# EAGLE design shield (EAGLE 6.4)
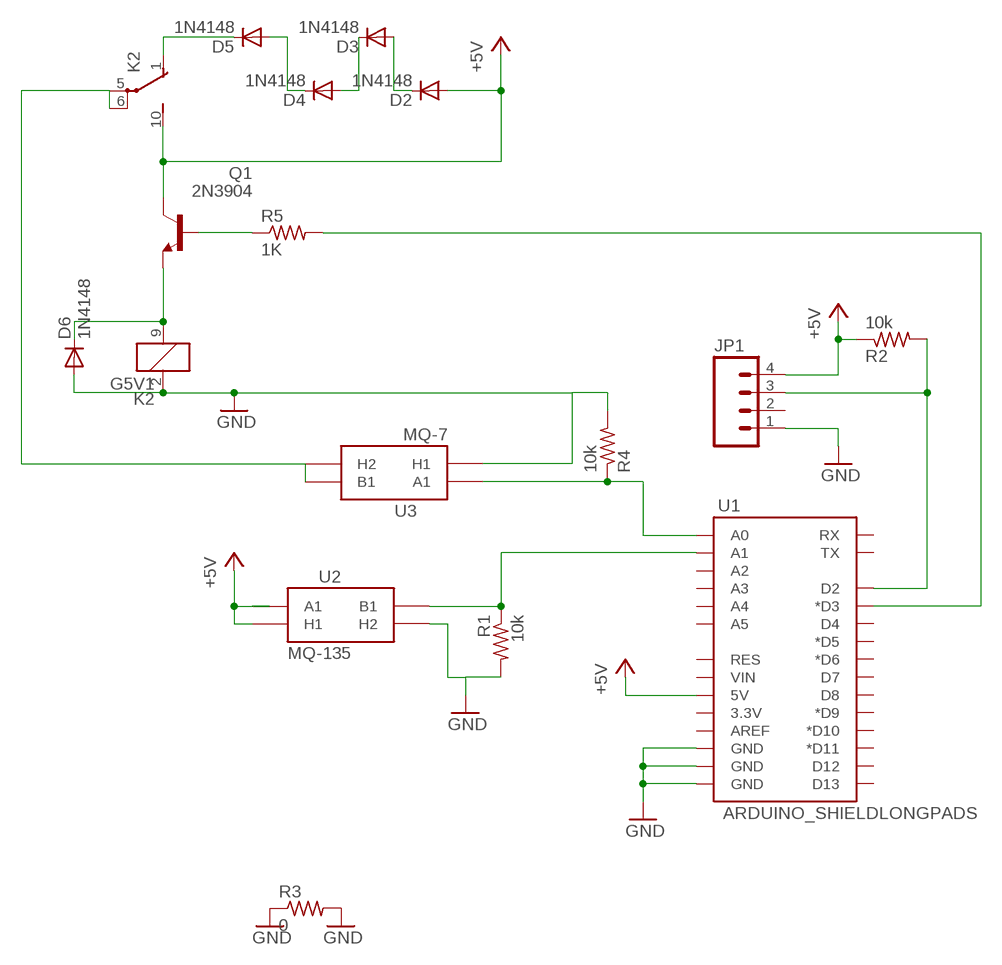
[diagram p0: schematic, sheet 1]

## Parts
D2  1N4148  1N4148DO35-7  [DO35-7]
D3  1N4148  1N4148DO35-7  [DO35-7]
D4  1N4148  1N4148DO35-7  [DO35-7]
D5  1N4148  1N4148DO35-7  [DO35-7]
D6  1N4148  1N4148DO35-7  [DO35-7]
JP1  M04LONGPADS  [1X04_LONGPADS]
K2  G5V1  [G5V1]
Q1  2N3904  [TO92]
R1  10k  R-US_0204/7  [0204/7]
R2  10k  R-US_0204/7  [0204/7]
R3  0  R-US_0204/7  [0204/7]
R4  10k  R-US_0204/7  [0204/7]
R5  1K  R-US_0204/7  [0204/7]
U1  ARDUINO_SHIELDLONGPADS  [DUEMILANOVE_SHIELD_LONGPADS]
U2  MQ-135  GAS_SENSOR  [MQ-3]
U3  MQ-7  GAS_SENSOR  [MQ-3]

## Nets
+5V: D2.A JP1.4 K2.10(2:S) Q1.1(C) R2.1 U1.5V U2.A1 U2.HA(H1)
GND: D6.A JP1.1 K2.2 R1.2 R3.1 R3.2 R4.2 U1.GND@0(GND) U1.GND@1(GND) U1.GND@2(GND) U2.HB(H2) U3.HA(H1)
N$1: R5.2 U1.D3(*D3)
N$2: R1.1 U1.A1 U2.B1
N$3: JP1.3 R2.2 U1.D2
N$7: D2.C D3.A
N$8: K2.5(2:P) K2.6(2:P) U3.B1 U3.HB(H2)
N$9: D3.C D4.A
N$10: D4.C D5.A
N$11: D5.C K2.1(2:O)
N$16: D6.C K2.9 Q1.3(E)
N$18: Q1.2(B) R5.1
SENSOROUT: R4.1 U1.A0 U3.A1
Unconnected: JP1.2 U1.3.3V U1.A2 U1.A3 U1.A4 U1.A5 U1.AREF U1.D4 U1.D5(*D5) U1.D6(*D6) U1.D7 U1.D8 U1.D9(*D9) U1.D10(*D10) U1.D11(*D11) U1.D12 U1.D13 U1.RES U1.RX U1.TX U1.VIN

## Library data of the parts
D2-D6 = diode:1N4148: DIODE high speed (Philips)
JP1 = SparkFun-Connectors:M04: Header 4 Standard 4-pin 0.1" header. Use with straight break away headers (SKU : PRT-00116), right angle break away headers (PRT-00553), swiss pins (PRT-00743), machine pins (PRT-00117), and female headers (PRT-00115). Molex polarized connector foot print use with SKU : PRT-08231 with associated crimp pins and housings. 1MM SMD Version SKU: PRT-10208
K2 = relay:G5V1: RELAY 1 x switch, 0.5 A/125 V AC, 1 A/24 V DC , Omron
Q1 = transistor-npn:2N3904: NPN Transistor
R1 R2 R4 = rcl:R-US_: RESISTOR, American symbol
R3 R5 = resistor:R-US_: RESISTOR, American symbol
U1 = SparkFun-Boards:ARDUINO_SHIELD: Arduino shield footprint
U2 = SparkFun-Sensors:GAS_SENSOR: MQ-3 alcohol gas sensor . FP not tested. SEN-08880.
U3 = SparkFun 2:GAS_SENSOR: MQ-3 Gas Sensor. FP not tested. Part#

## Net classes
0 default: clearance 0.355 mm

## Board
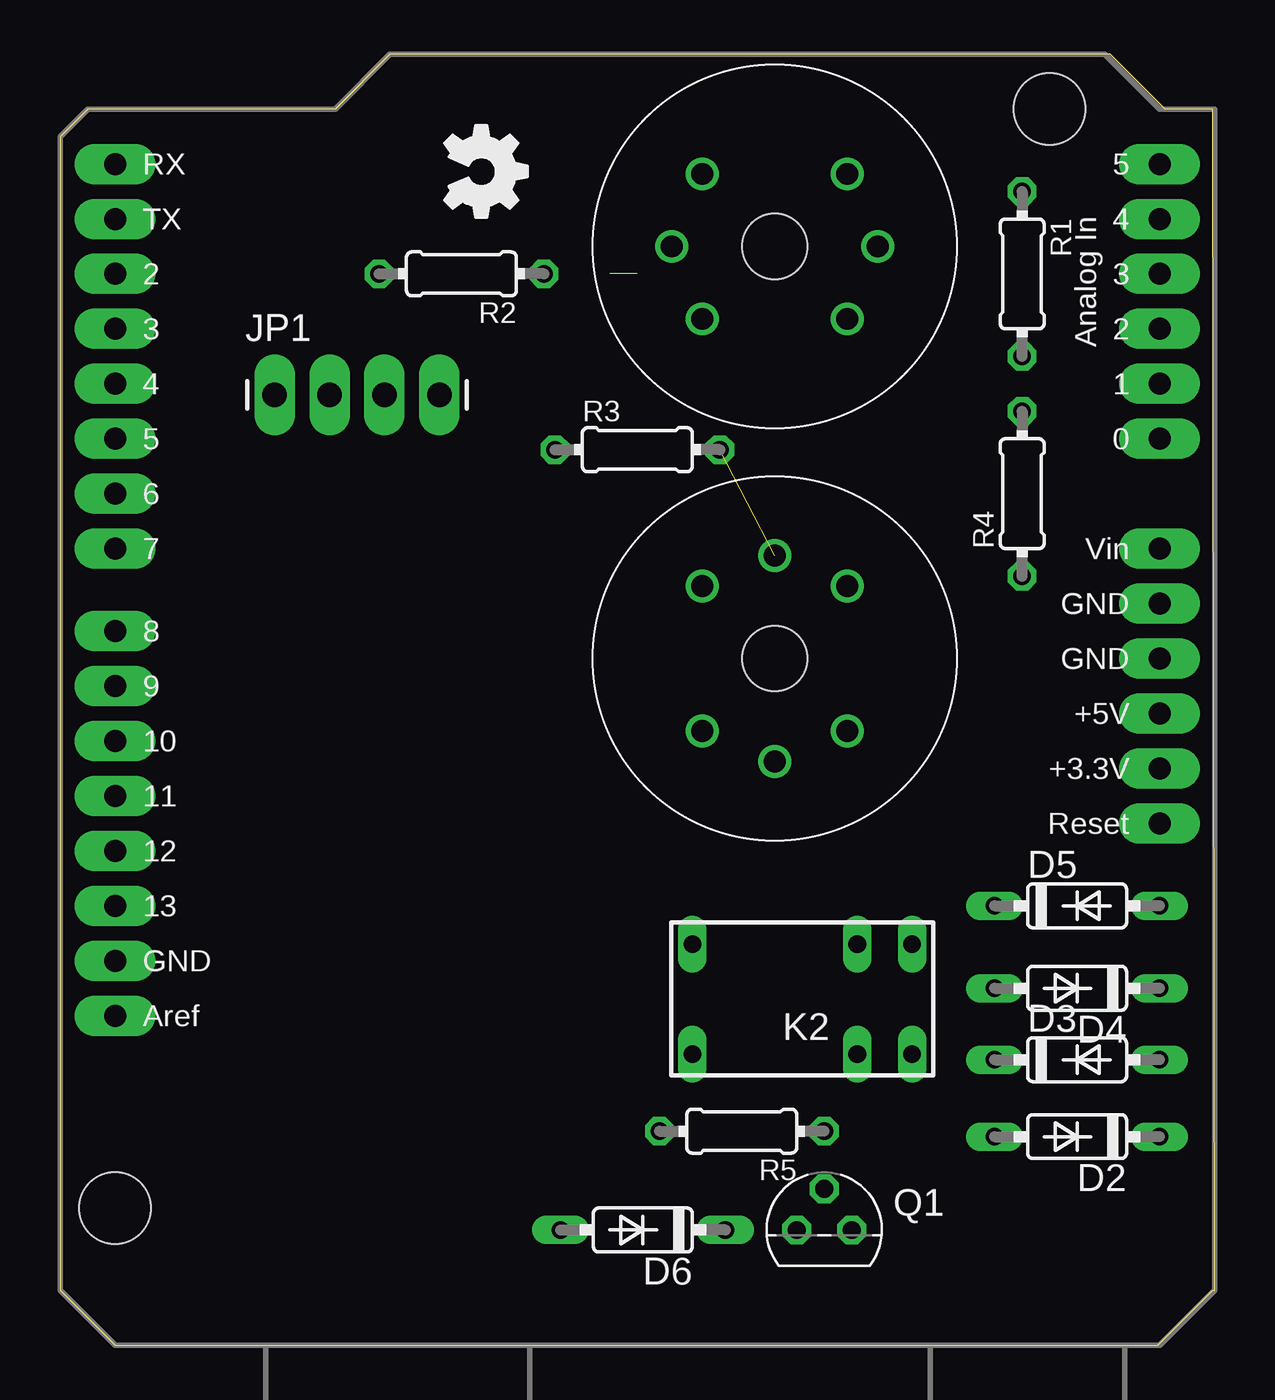
[diagram p1: board, top side]
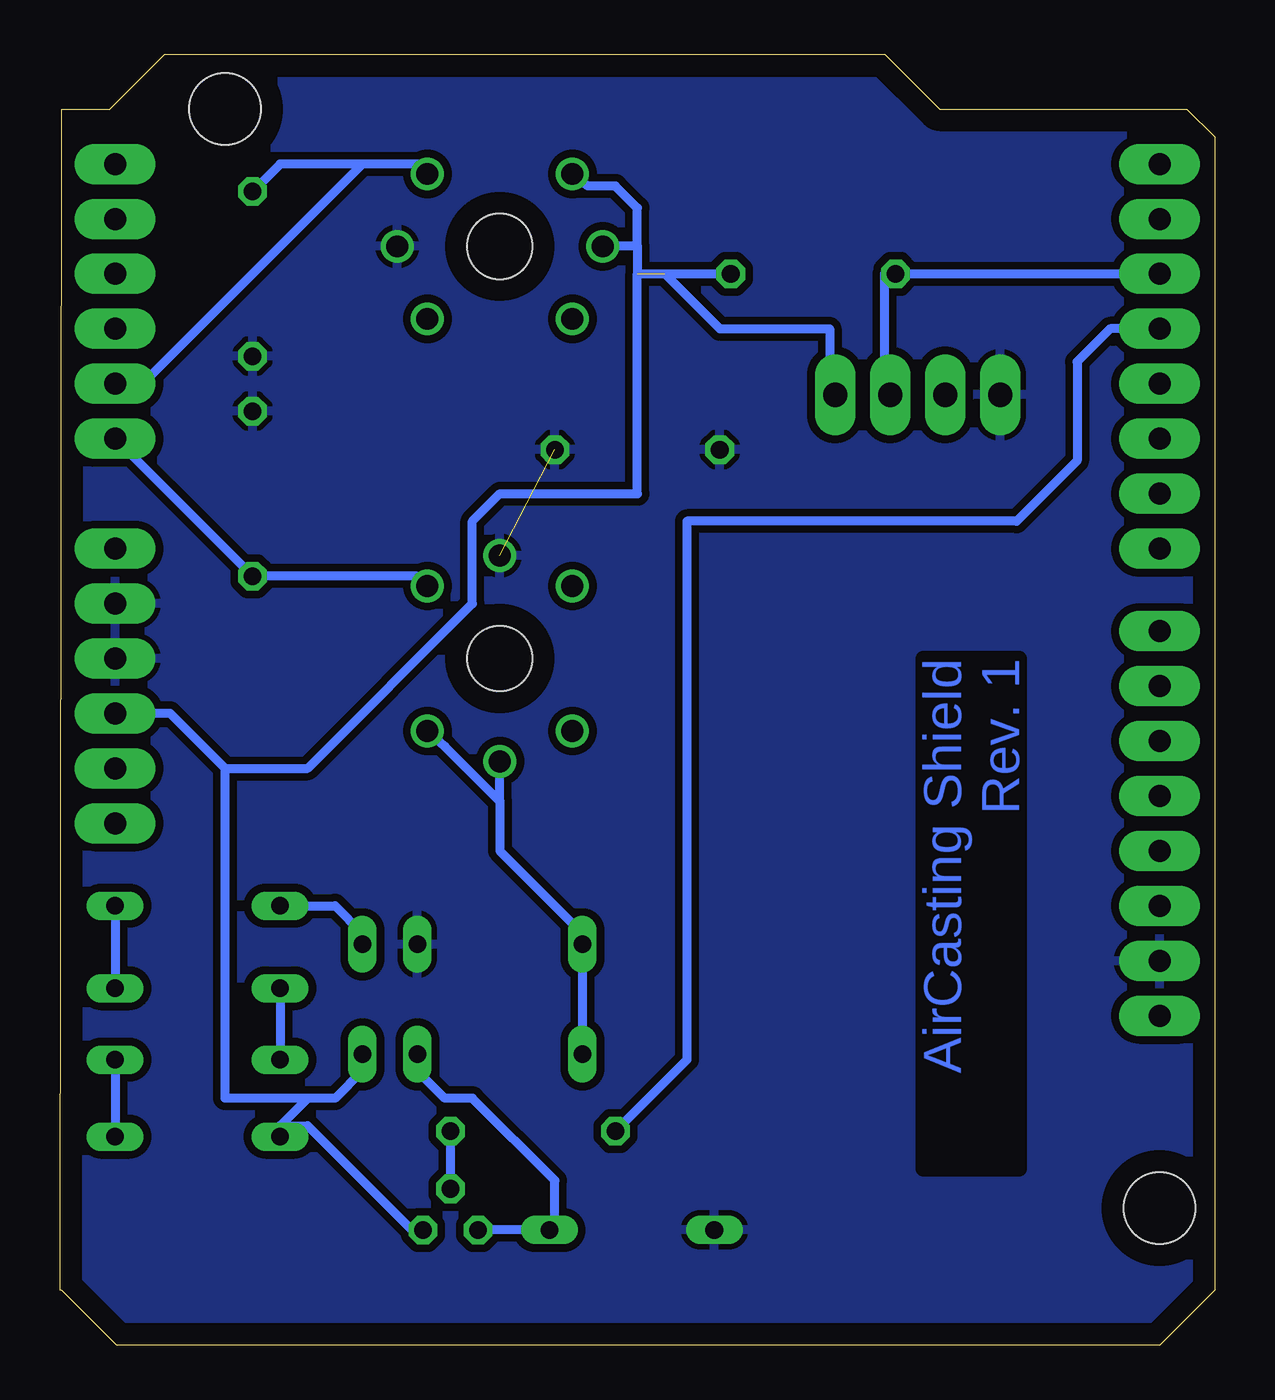
[diagram p2: board, bottom side, seen from below]

Size 53.34 x 59.69 mm. Coordinates in mm from the lower left corner, seen from the top.
Outline: 0,2.54 2.54,0 50.72,0 53.26,2.54 53.34,2.54 53.26,57.14 53.25,57.15 51.05,57.15 48.51,59.69 15.24,59.69 12.7,57.15 1.28,57.15 0,55.87 0,2.54
Copper layers (1*16): Top 0.035mm / dielectric 1.5mm / Bottom 0.035mm
Design rules "default *": minimum track width 16mil, minimum drill 24mil, track to track 12mil, track to pad 12mil, pad to pad 10mil, via to via 10mil, smd to smd 8mil, copper to edge 40mil, drill to drill 10mil, minimum pad ring 10mil, minimum via ring 8mil, stop-mask expansion 4mil, vias tented up to drill 0mil, thermal gap 10mil

### Footprints (pad centres in the part's own frame; a part is rotated, then mirrored left to right if it is on the bottom)
DO35-7 = drill 0.813 long: A 3.81,0; C -3.81,0
1X04_LONGPADS = drill 1.118 pad 1.88 long: 1 0,0; 2 2.54,0; 3 5.08,0; 4 7.62,0
G5V1 = drill 0.813 long: 1 -5.08,-2.54; 2 -2.54,-2.54; 5 5.08,-2.54; 6 5.08,2.54; 9 -2.54,2.54; 10 -5.08,2.54
TO92 = drill 0.813 octagon: 1 1.27,0; 2 0,1.905; 3 -1.27,0
0204/7 = drill 0.813 octagon: 1 -3.81,0; 2 3.81,0
DUEMILANOVE_SHIELD_LONGPADS = drill 1.016 pad 1.88 long: 3.3V 50.8,26.67; 5V 50.8,29.21; A0 50.8,41.91; A1 50.8,44.45; A2 50.8,46.99; A3 50.8,49.53; A4 50.8,52.07; A5 50.8,54.61; AREF 2.54,15.24; D2 2.54,49.53; D3 2.54,46.99; D4 2.54,44.45; D5 2.54,41.91; D6 2.54,39.37; D7 2.54,36.83; D8 2.54,33.02; D9 2.54,30.48; D10 2.54,27.94; D11 2.54,25.4; D12 2.54,22.86; D13 2.54,20.32; GND@0 50.8,31.75; GND@1 50.8,34.29; GND@2 2.54,17.78; RES 50.8,24.13; RX 2.54,54.61; TX 2.54,52.07; VIN 50.8,36.83 | hole 3.302: 45.72,57.15; 2.54,6.35
MQ-3 = drill 1.016: A1 -3.35,3.35; A2 -3.35,-3.35; B1 3.35,3.35; B2 3.35,-3.35; HA -4.75,0; HB 4.75,0 | hole 3: 0,0

### Placement (x,y rotation side)
D2  46.99,9.65 180 top
D3  46.99,13.21 0 top
D4  46.99,16.51 180 top
D5  46.99,20.32 0 top
D6  26.92,5.33 180 top
JP1  9.91,43.94 0 top
K2  34.29,16 180 top
Q1  35.31,5.33 0 top
R1  44.45,49.53 270 top
R2  18.54,49.53 180 top
R3  26.67,41.4 0 top
R4  44.45,39.37 90 top
R5  31.5,9.91 180 top
U1  0,0 0 top
U2  33.02,50.8 0 top
U3  33.02,31.75 270 top
U$1  [OSHW_FILLX150_NOTEXT]  17.78,56.39 270 top

### Tracks (layer width: path | path; a pad name or v marks a point on that pad's centre or on a via)
+5V  (1 unrouted)
  Bottom 0.406: 26.67,49.53 R2.1 | 26.67,50.8 26.67,49.53 | 26.67,50.8 U2.HA | 26.67,50.8 26.67,52.58 27.69,53.59 28.96,53.59 U2.A1 | 25.4,49.53 22.86,46.99 17.78,46.99 17.78,44.45 JP1.4 | 41.91,11.43 43.18,10.16 | 41.91,11.43 40.64,11.43 39.37,12.7 K2.10 | U1.5V 48.26,29.21 45.72,26.67 | 45.72,26.67 45.72,11.43 41.91,11.43 | 26.67,49.53 26.67,39.37 33.02,39.37 34.29,38.1 34.29,34.29 41.91,26.67 45.72,26.67 | 43.18,10.16 41.91,10.16 37.08,5.33 Q1.1 | 43.18,10.16 D2.A
GND  (1 unrouted)
  pour Bottom: 12.95,56.64 1.78,56.64 0.51,55.37 0.51,3.05 3.05,0.51 50.55,0.51 52.83,2.79 52.83,56.39 52.58,56.64 50.55,56.64 50.29,56.39 50.29,56.9 48.26,58.93 15.24,58.93
N$1
  Bottom 0.406: U1.D3 4.83,46.99 6.35,45.47 6.35,40.89 9.14,38.1 24.38,38.1 24.38,13.21 R5.2
N$2
  Bottom 0.406: R1.1 43.18,54.61 39.37,54.61 | 39.37,54.61 36.83,54.61 U2.B1 | U1.A1 49.53,44.45 39.37,54.61
N$3
  Bottom 0.406: JP1.3 15.24,44.45 15.24,49.53 R2.2 U1.D2
N$7
  Bottom 0.406: D3.A D2.C
N$8
  Bottom 0.406: K2.6 K2.5 29.21,19.05 33.02,22.86 33.02,25.15 | 33.02,25.15 35.56,27.69 U3.B1 | 33.02,25.15 U3.HB
N$9
  Bottom 0.406: D4.A D3.C
N$10
  Bottom 0.406: D5.A D4.C
N$11
  Bottom 0.406: D5.C 40.64,20.32 39.37,19.05 K2.1
N$16
  Bottom 0.406: Q1.3 D6.C 30.48,5.59 30.48,7.62 34.29,11.43 35.56,11.43 36.83,12.7 K2.9
N$18
  Bottom 0.406: R5.1 Q1.2
SENSOROUT
  Bottom 0.406: U3.A1 36.83,35.56 R4.1 U1.A0

### Text on the board
Bottom: AirCasting Shield / Rev. 1